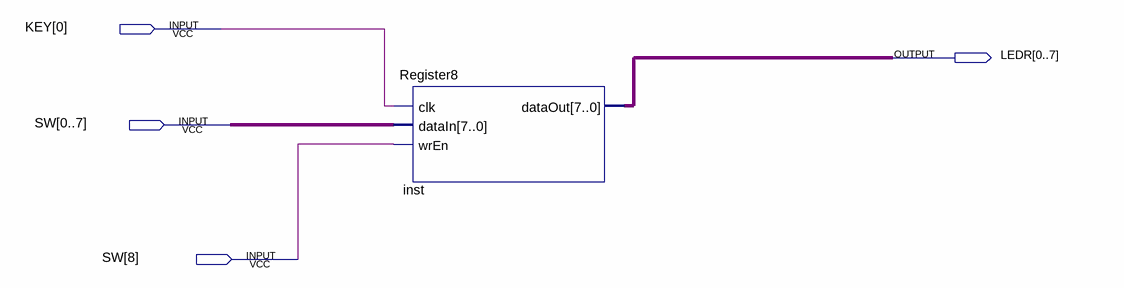
[diagram p0: schematic sheet]
// Quartus schematic Block1.bdf as structural Verilog: 1 symbols, 4 pins
module Block1 (
  input  [0:0] KEY,
  input  [0:8] SW,
  output [0:7] LEDR
);

  Register8 inst (.clk(KEY[0]), .dataIn(SW[0:7]), .wrEn(SW[8]), .dataOut(LEDR));
endmodule
